# Altium schematic sheet Sheet2.SchDoc: Наименование
size 420 x 297 mm; ApprovedBy: Утвердил; CheckedBy: Проверил; Author: Разработал; CompanyName: Тесла Тек; DrawnBy: Н.Контр; Engineer: Т.Контр; SheetNumber: 1; SheetTotal: 1; PageSetup: Record=PageOptions|CenterHorizontal=True|CenterVertical=True|PrintScale=0.94|XCorrection=1.00|YCorrection=1.00|PrintKind=1|BorderSize=5000000|LeftOffset=0|BottomOffset=0|Orientation=1|PaperLength=1000|PaperWidth=1000|Scale=100|PaperSource=7|PrintQuality=-4|MediaType=1|DitherType=10|PaperKind=A4|PrintScaleMode=1; DecimalNumber: Децимальный номер; HeadOfSector: Нач. сектора; MainDevice: Перв.примен.; Name: Наименование; Обозначение документа: PCB -/-; Номер листа: 2; DocumentName: Sheet1.SCHDOC
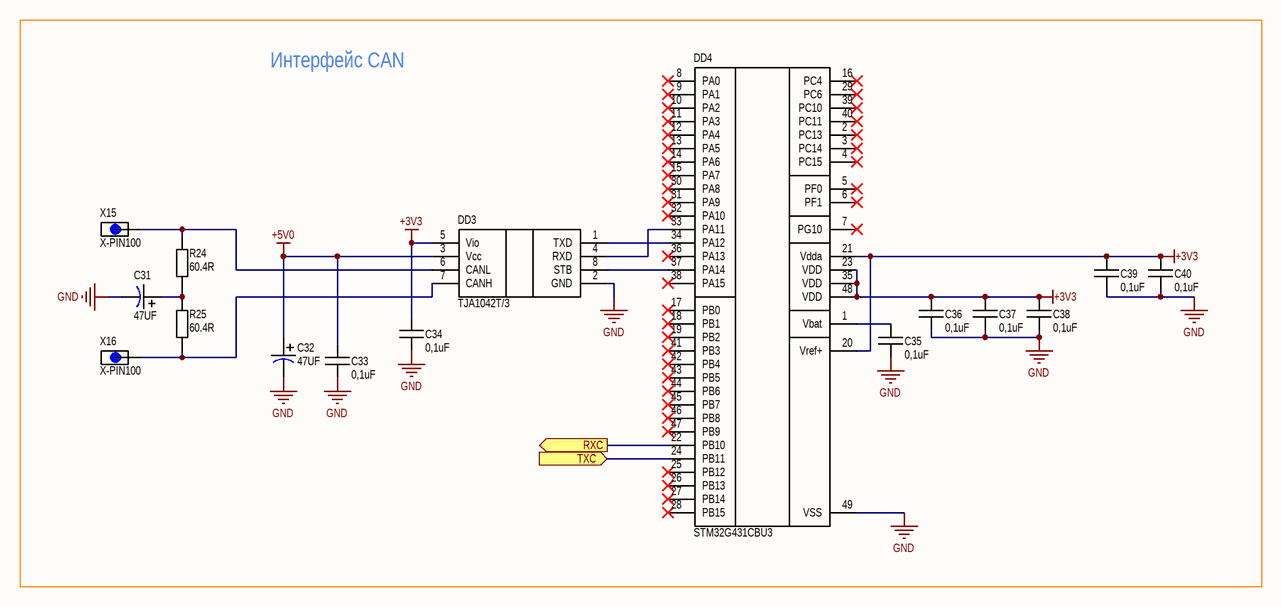
[diagram p0: Sheet2.SchDoc]

## Parts
C31  47UF  [B1411_3528]
C32  47UF  [B1411_3528]
C33  0,1uF  [0805C]
C34  0,1uF  [0805C]
C35  0,1uF  [0805C]
C36  0,1uF  [0805C]
C37  0,1uF  [0805C]
C38  0,1uF  [0805C]
C39  0,1uF  [0805C]
C40  0,1uF  [0805C]
DD3  TJA1042T/3  [SOIC-8]
DD4  STM32G431CBU3  [TQFP-64]
R24  60.4R  [R0805]
R25  60.4R  [R0805]
X15  X-PIN100  [Xpin100]
X16  X-PIN100  [Xpin100]

## Blocks framed on the sheet
Интерфейс CAN: C31-C40 DD3 DD4 R24 R25 X15 X16

## Ports
RXC (out), TXC (in)

## Nets
+3V3: C34.1 C36.1 C37.1 C38.1 C39.1 C40.1 DD3.5(Vio) DD4.20(Vref+) DD4.21(Vdda) DD4.23(VDD) DD4.35(VDD) DD4.48(VDD)
+5V0: C32.1 C33.1 DD3.3(Vcc)
GND: C31.2 C32.2 C33.2 C34.2 C35.2 C36.2 C37.2 C38.2 C39.2 C40.2 DD3.2(GND) DD4.49(VSS)
RXC: DD4.22(PB10) ; port RXC
TXC: DD4.24(PB11) ; port TXC
NetC31_1: C31.1 R24.1 R25.2
NetC35_1: C35.1 DD4.1(Vbat)
NetDD3_1: DD3.1(TXD) DD4.34(PA12)
NetDD3_4: DD3.4(RXD) DD4.33(PA11)
NetDD3_6: DD3.6(CANL) R24.2 X15.1
NetDD3_7: DD3.7(CANH) R25.1 X16.1
NetDD3_8: DD3.8(STB) DD4.37(PA14)

Not connected (* = marked no-connect by the designer): DD4 2(PC13)* 3(PC14)* 4(PC15)* 5(PF0)* 6(PF1)* 7(PG10)* 8(PA0)* 9(PA1)* 10(PA2)* 11(PA3)* 12(PA4)* 13(PA5)* 14(PA6)* 15(PA7)* 16(PC4)* 17(PB0)* 18(PB1)* 19(PB2)* 25(PB12)* 26(PB13)* 27(PB14)* 28(PB15)* 29(PC6)* 30(PA8)* 31(PA9)* 32(PA10)* 36(PA13)* 38(PA15)* 39(PC10)* 40(PC11)* 41(PB3)* 42(PB4)* 43(PB5)* 44(PB6)* 45(PB7)* 46(PB8)* 47(PB9)*

## Notes on the sheet
- Подп. и дата
- Инв. № дубл.
- Взам. инв. №
- Инв. № подл.
- Изм.
- Лист
- № докум.
- Подп.
- Дата
- Копировал
- Формат А3

## Library data of the parts
C31 C32 = CP1411B-47UF: CP1411B 47UF 6V3; Part Number: SMD CAP TANTAL 47uF ±10% 6V3 1411B; Added_by: ridel_av@teslatec.ru; Pkg: 1411B; Solder_Amount: 2; Created_at: 21/04/2025; Mount: MOUNT; MountType: SMD
C33-C40 = C0805-0,1uF: C0805 0,1uF; Part Number: SMD CAP CER 0.1uF ±10% 25V X7R 0805; Added_by: ridel_av@teslatec.ru; Pkg: 0805; Solder_Amount: 2; Created_at: 21/04/2025; Mount: MOUNT; MountType: SMD
DD3 = TJA1042T/3: High-speed CAN transceiver with Standby mode; Added_by: dolgopolova_ia@teslatec.ru; Solder_Amount: 8; Created_at: 03/09/2025; Mount: MOUNT; MountType: SMD; Part Number: TJA1042T/3; Pkg: SOIC-8
DD4 = STM32G431CBU3: Arm Cortex-M4 32b MCU+FPU, 170 MHz / 213 DMIPS, 128 KB Flash; Added_by: ridel_av@teslatec.ru; Pkg: UFQFPN-48; Solder_Amount: 49; Created_at: 21/04/2025; Mount: MOUNT; MountType: SMD; Part Number: STM32G431CBU3
R24 R25 = R0805-60.4R: R0805 SMD 60.4R OHM 1% ±100ppm/°C; Part Number: SMD RES 60.4 OHM 1% ±100ppm/°C 0805; Added_by: ridel_av@teslatec.ru; Pkg: 0805; Solder_Amount: 2; Created_at: 21/04/2025; Mount: MOUNT; MountType: SMD
X15 X16 = X-PIN100: Added_by: ridel_av@teslatec.ru; Solder_Amount: 2; Created_at: 21/04/2025; Mount: MOUNT; MountType: SMD